# EAGLE schematic Schematic v23 (EAGLE 9.7.0)
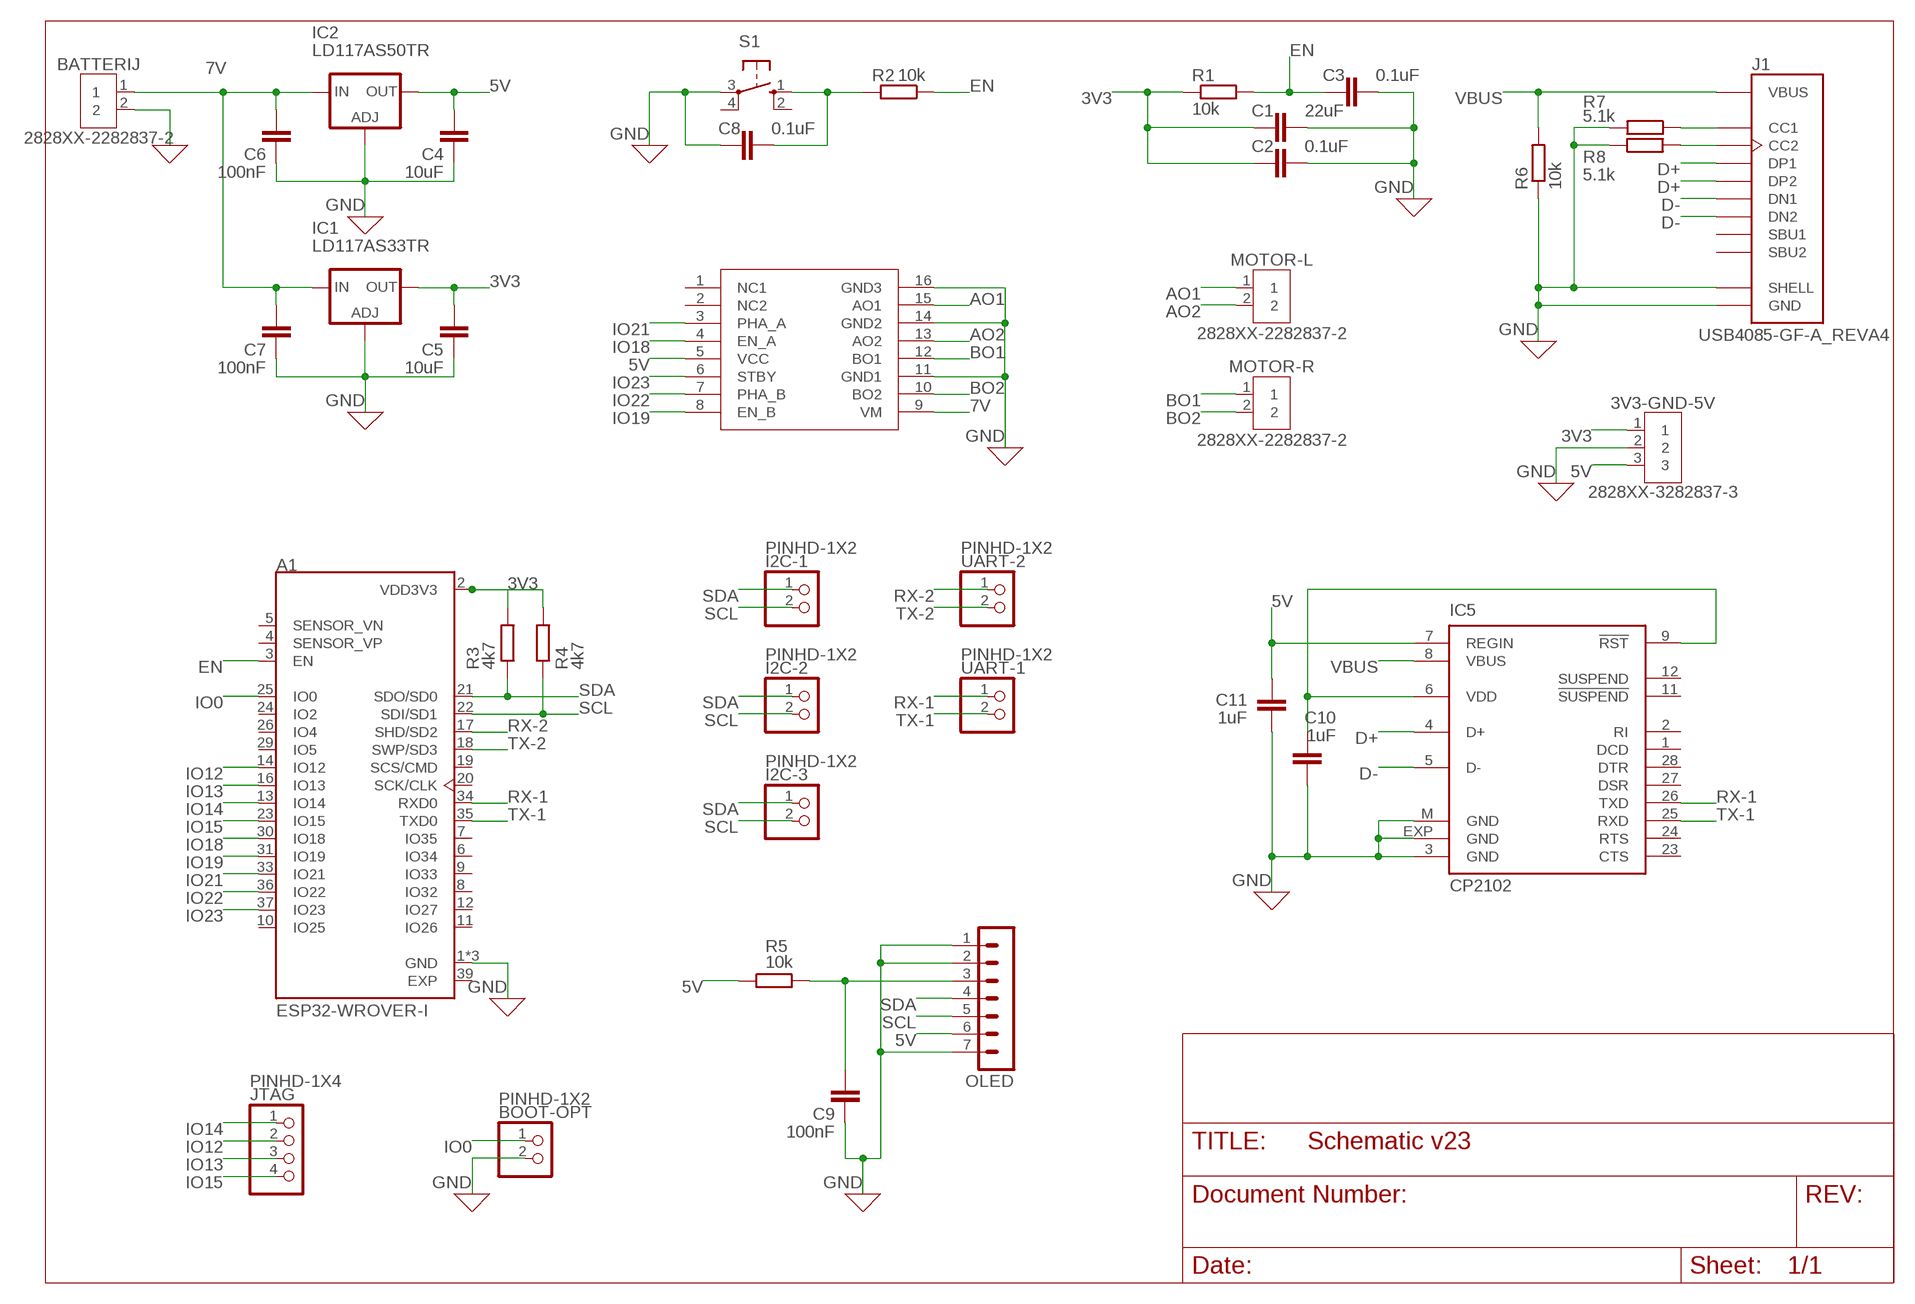
[diagram p0: schematic, sheet 1]

## Parts
3V3-GND-5V  2828XX-3282837-3  [TERMBLK_508-3N]
A1  ESP32-WROVER-I  [XCVR_ESP32-WROVER-I]
BATTERIJ  2828XX-2282837-2  [TERMBLK_508-2N]
BOOT-OPT  PINHD-1X2  [1X02]
C1  22uF  C-EUC0805  [C0805]
C2  0.1uF  C-EUC0805  [C0805]
C3  0.1uF  C-EUC0805  [C0805]
C4  10uF  C-EUC0805  [C0805]
C5  10uF  C-EUC0805  [C0805]
C6  100nF  C-EUC0805  [C0805]
C7  100nF  C-EUC0805  [C0805]
C8  0.1uF  C-EUC0805  [C0805]
C9  100nF  C-EUC0805  [C0805]
C10  1uF  C-EUC0805  [C0805]
C11  1uF  C-EUC0805  [C0805]
I2C-1  PINHD-1X2  [1X02]
I2C-2  PINHD-1X2  [1X02]
I2C-3  PINHD-1X2  [1X02]
IC1  LD117AS33TR  [SOT223]
IC2  LD117AS50TR  [SOT223]
IC5  CP2102  [MLP28]
J1  USB4085-GF-A_REVA4  [GCT_USB4085-GF-A_REVA4]
JTAG  PINHD-1X4  [1X04]
MOTOR-DRIVER  TC78H621FNG  [SOP65P640X110-16N]
MOTOR-L  2828XX-2282837-2  [TERMBLK_508-2N]
MOTOR-R  2828XX-2282837-2  [TERMBLK_508-2N]
OLED  MA07-1  [MA07-1]
R1  10k  R-EU_R0805  [R0805]
R2  10k  R-EU_R0805  [R0805]
R3  4k7  R-EU_R0805  [R0805]
R4  4k7  R-EU_R0805  [R0805]
R5  10k  R-EU_R0805  [R0805]
R6  10k  R-EU_R0805  [R0805]
R7  5.1k  R-EU_R0805  [R0805]
R8  5.1k  R-EU_R0805  [R0805]
S1  10-XX  [B3F-10XX]
UART-1  PINHD-1X2  [1X02]
UART-2  PINHD-1X2  [1X02]

## Nets
3V3: 3V3-GND-5V.1 A1.2(VDD3V3) C1.1 C2.1 C5.2 IC1.4(OUT) R1.1 R3.2 R4.2
5V: 3V3-GND-5V.3 C4.2 C11.1 IC2.4(OUT) IC5.7(REGIN) MOTOR-DRIVER.5(VCC) OLED.6 R5.1
7V: BATTERIJ.1 C6.2 C7.2 IC1.3(IN) IC2.3(IN) MOTOR-DRIVER.9(VM)
AO1: MOTOR-DRIVER.15(AO1) MOTOR-L.1
AO2: MOTOR-DRIVER.13(AO2) MOTOR-L.2
BO1: MOTOR-DRIVER.12(BO1) MOTOR-R.1
BO2: MOTOR-DRIVER.10(BO2) MOTOR-R.2
D+: IC5.4(D+) J1.A6(DP1) J1.B6(DP2)
D-: IC5.5(D-) J1.A7(DN1) J1.B7(DN2)
EN: A1.3(EN) C3.1 R1.2 R2.1
GND: 3V3-GND-5V.2 A1.1(GND) A1.15(GND) A1.38(GND) BATTERIJ.2 BOOT-OPT.2 C1.2 C2.2 C3.2 C4.1 C5.1 C6.1 C7.1 C8.1 C9.1 C10.2 C11.2 IC1.1(ADJ) IC2.1(ADJ) IC5.3(GND) IC5.EXP(GND) IC5.M(GND) J1.A1(GND) J1.A12(GND) J1.B1(GND) J1.B12(GND) J1.P1(SHELL) J1.P2(SHELL) J1.P3(SHELL) J1.P4(SHELL) MOTOR-DRIVER.11(GND1) MOTOR-DRIVER.14(GND2) MOTOR-DRIVER.16(GND3) OLED.1 OLED.2 OLED.7 R6.1 R7.2 R8.1 S1.3(P)
IO0: A1.25(IO0) BOOT-OPT.1
IO12: A1.14(IO12) JTAG.2
IO13: A1.16(IO13) JTAG.3
IO14: A1.13(IO14) JTAG.1
IO15: A1.23(IO15) JTAG.4
IO18: A1.30(IO18) MOTOR-DRIVER.4(EN_A)
IO19: A1.31(IO19) MOTOR-DRIVER.8(EN_B)
IO21: A1.33(IO21) MOTOR-DRIVER.3(PHA_A)
IO22: A1.36(IO22) MOTOR-DRIVER.7(PHA_B)
IO23: A1.37(IO23) MOTOR-DRIVER.6(STBY)
N$1: J1.A5(CC1) R7.1
N$2: C9.2 OLED.3 R5.2
N$3: C8.2 R2.2 S1.1(S)
N$4: J1.B5(CC2) R8.2
N$5: C10.1 IC5.6(VDD) IC5.9(!RST)
RX-1: A1.34(RXD0) IC5.26(TXD) UART-1.1
RX-2: A1.17(SHD/SD2) UART-2.1
SCL: A1.22(SDI/SD1) I2C-1.2 I2C-2.2 I2C-3.2 OLED.5 R4.1
SDA: A1.21(SDO/SD0) I2C-1.1 I2C-2.1 I2C-3.1 OLED.4 R3.1
TX-1: A1.35(TXD0) IC5.25(RXD) UART-1.2
TX-2: A1.18(SWP/SD3) UART-2.2
VBUS: IC5.8(VBUS) J1.A4(VBUS) J1.A9(VBUS) J1.B4(VBUS) J1.B9(VBUS) R6.2
Unconnected: A1.4(SENSOR_VP) A1.5(SENSOR_VN) A1.6(IO34) A1.7(IO35) A1.8(IO32) A1.9(IO33) A1.10(IO25) A1.11(IO26) A1.12(IO27) A1.19(SCS/CMD) A1.20(SCK/CLK) A1.24(IO2) A1.26(IO4) A1.29(IO5) IC5.1(DCD) IC5.2(RI) IC5.11(!SUSPEND) IC5.12(SUSPEND) IC5.23(CTS) IC5.24(RTS) IC5.27(DSR) IC5.28(DTR) J1.A8(SBU1) J1.B8(SBU2) MOTOR-DRIVER.1(NC1) MOTOR-DRIVER.2(NC2) S1.2(S1) S1.4(P1)

## Power pins joined to a net without a drawn wire
EXP: A1.39(EXP)

## Library data of the parts
3V3-GND-5V = Connector:2828XX-3: 3 Position Wire to Board Terminal Block Horizontal with Board Datasheet <https://www.te.com.cn/commerce/DocumentDelivery/DDEController?Action=showdoc&DocId=Catalog+Section%7F1308389_EUROSTYLE_TERMINAL_BLOCKS%7F0607%7Fpdf%7FEnglish%7FENG_CS_1308389_EUROSTYLE_TERMINAL_BLOCKS_0607.pdf%7F2-282837-5>; CATEGORY: Connector; DESCRIPTION: TERM BLK 3P SIDE ENT 5.08mm PCB; MANUFACTURER: TE Connectivity; MPN: 282837-3; OPERATING_TEMPERATURE: -40°C to +105°C; PART_STATUS: Active; ROHS_COMPLIANCE: RoHS Compliant; SERIES: 282837; SUBCATEGORY: Terminal Block; TYPE: Side Wire Entry
A1 = ESP32-WROVER-I:ESP32-WROVER-I: Module: combo; GPIO, I2C x2, I2S x2, SDIO, SPI x3, UART x3; U.FL; DESCRIPTION: Module: combo; GPIO, I2C x2, I2S x2, SDIO, SPI x3, UART x3; U.FL; DIGI-KEY_PART_NUMBER: 1904-1008-1-ND; DIGI-KEY_PURCHASE_URL: https://www.digikey.com/product-detail/en/espressif-systems/ESP32-WROVER-I/1904-1008-1-ND/8544303?utm_source=snapeda&utm_medium=aggregator&utm_campaign=symbol; MF: Espressif Systems; MP: ESP32-WROVER-I; PACKAGE: Module Espressif Systems
BATTERIJ MOTOR-L MOTOR-R = Connector:2828XX-2: 2 Position Wire to Board Terminal Block Horizontal with Board Datasheet <https://www.te.com.cn/commerce/DocumentDelivery/DDEController?Action=showdoc&DocId=Catalog+Section%7F1308389_EUROSTYLE_TERMINAL_BLOCKS%7F0607%7Fpdf%7FEnglish%7FENG_CS_1308389_EUROSTYLE_TERMINAL_BLOCKS_0607.pdf%7F2-282837-5>; CATEGORY: Connector; DESCRIPTION: 2 Position Wire to Board Terminal Block Horizontal with Board 5.08 mm Through Hole; MANUFACTURER: TE Connectivity; MPN: 282837-2; OPERATING_TEMPERATURE: -40°C to +105°C; PART_STATUS: ACTIVE; ROHS_COMPLIANCE: RoHS Compliant; SERIES: 282837; SUBCATEGORY: Terminal Block; TYPE: Side Wire Entry
BOOT-OPT I2C-1-I2C-3 UART-1 UART-2 = Connector:PINHD-1X2: PIN HEADER; CATEGORY: CONNECTOR; SUB-CATEGORY: PIN-HEADER
C1-C11 = rcl:C-EU: CAPACITOR, European symbol; SPICEPREFIX: C
IC1 IC2 = v-reg:LD117A?*: Low drop fixed and adjustable positive voltage regulators 1 A Source: http://www.st.com/stonline/products/literature/ds/7194/ld1117axx.pdf
IC5 = silabs:CP210*: Single-Chip USB to UART Bridge Source: www.silabs.com .. CP2101.pdf / cp2102.pdf; MF: FARNELL; MPN: CP2102-GM; OC_FARNELL: 9282130; OC_NEWARK: 30K5635
J1 = USB4085-GF-A_REVA4:USB4085-GF-A_REVA4: USB 2.0 Type C Receptacle Dip Type, PCB Top Mount; MANUFACTURER: Global Connector Technology; MAXIMUM_PACKAGE_HEIGHT: 3.46mm; PARTREV: A4; STANDARD: Manufacturer Recommendations
JTAG = Connector:PINHD-1X4: PIN HEADER; CATEGORY: CONNECTOR; SUB-CATEGORY: PIN-HEADER
MOTOR-DRIVER = TC78H621FNG:TC78H621FNG
OLED = con-lstb:MA07-1: PIN HEADER; OC_FARNELL: unknown; OC_NEWARK: unknown
R1-R8 = rcl:R-EU_: RESISTOR, European symbol; SPICEPREFIX: R
S1 = switch-omron:10-XX: OMRON SWITCH; MPN: B3F-1000; OC_FARNELL: 176432; OC_NEWARK: 36M3542